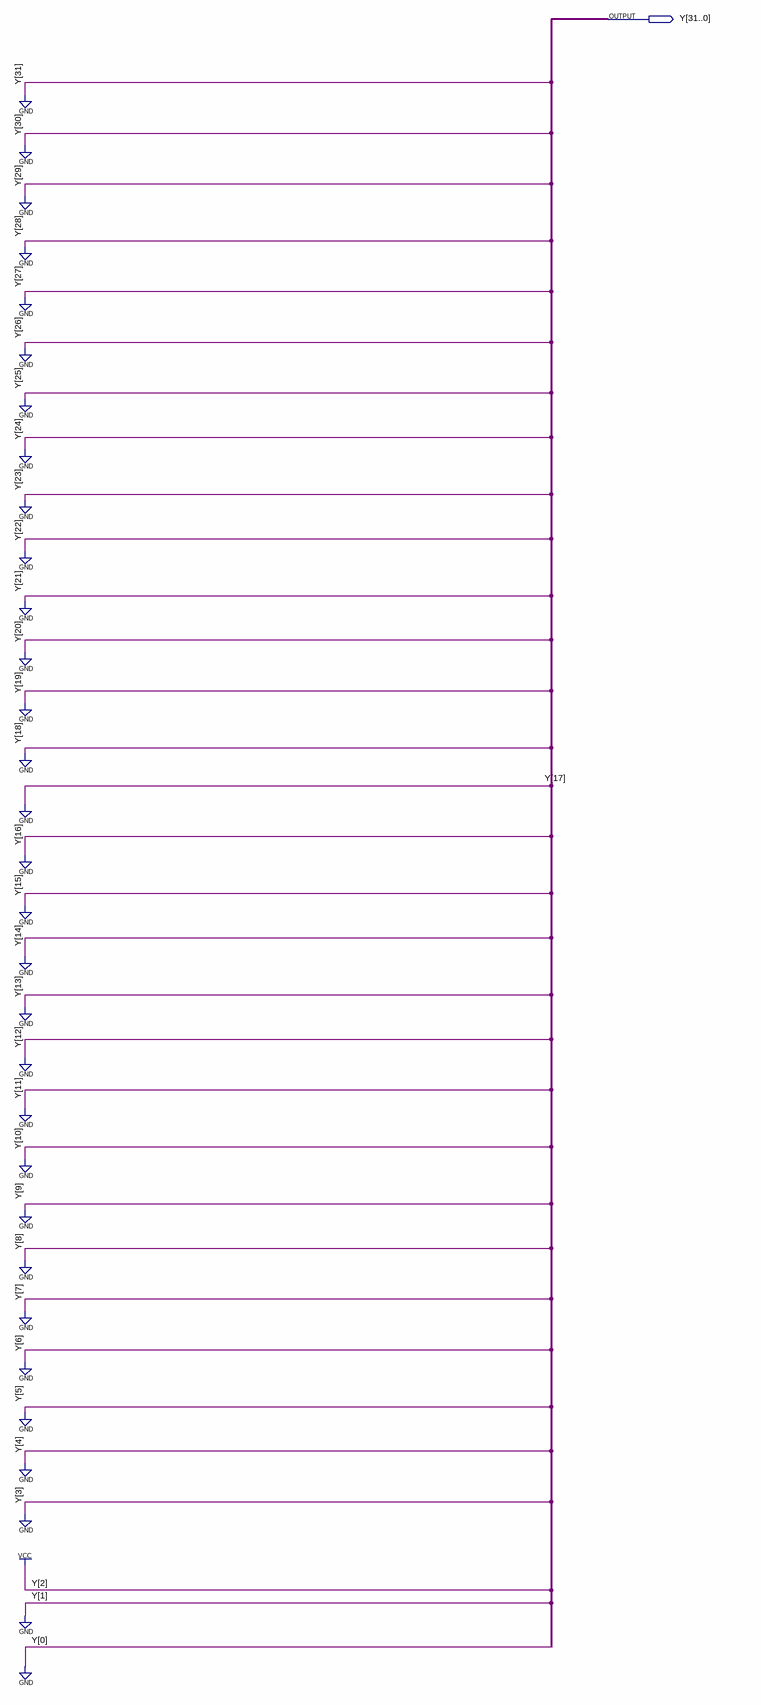
[diagram p0: schematic sheet]
// Quartus schematic Four.bdf as structural Verilog: 0 symbols, 1 pins
module Four (
  output [31:0] Y
);


  assign Y = 32'b00000000000000000000000000000100;
endmodule
